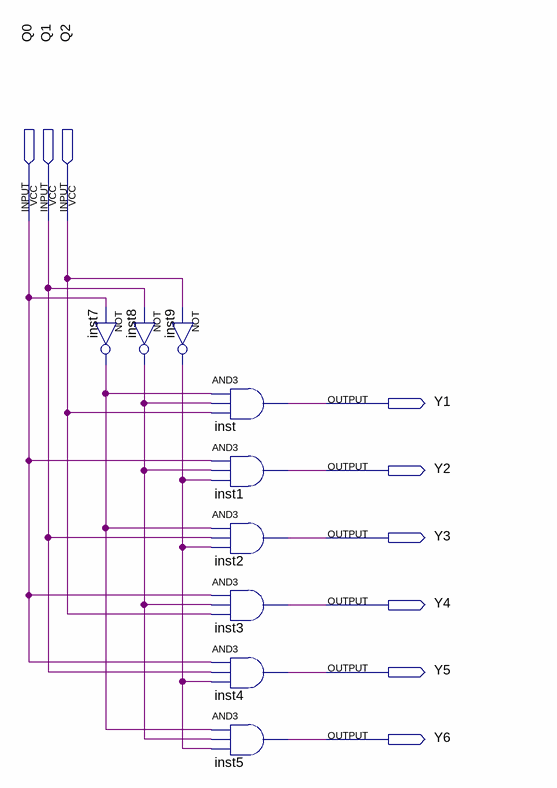
[diagram p0: schematic sheet]
// Quartus schematic Q_to_Y.bdf as structural Verilog: 9 symbols, 9 pins
module Q_to_Y (
  input  Q0,
  input  Q1,
  input  Q2,
  output Y1,
  output Y2,
  output Y3,
  output Y4,
  output Y5,
  output Y6
);

  wire inst7_out, inst8_out, inst9_out;

  not inst7 (inst7_out, Q0);
  not inst8 (inst8_out, Q1);
  not inst9 (inst9_out, Q2);
  and inst (Y1, inst7_out, inst8_out, Q2);
  and inst1 (Y2, Q0, inst8_out, inst9_out);
  and inst2 (Y3, inst7_out, Q1, inst9_out);
  and inst3 (Y4, Q0, inst8_out, Q2);
  and inst4 (Y5, Q0, Q1, inst9_out);
  and inst5 (Y6, inst7_out, inst8_out, inst9_out);
endmodule
